# Altium schematic sheet CAN_Bus.SchDoc: Hrafn
size Tabloid; DrawnBy: Nicholas Belsten; Organization: MIT; Address1: Route 40; Address2: Westford MA 01886; Address3: USA; DocumentNumber: 8; SheetNumber: 10; SheetTotal: 10; DCN: Aika; ProgramName: AERO-VISTA; Section: CAN
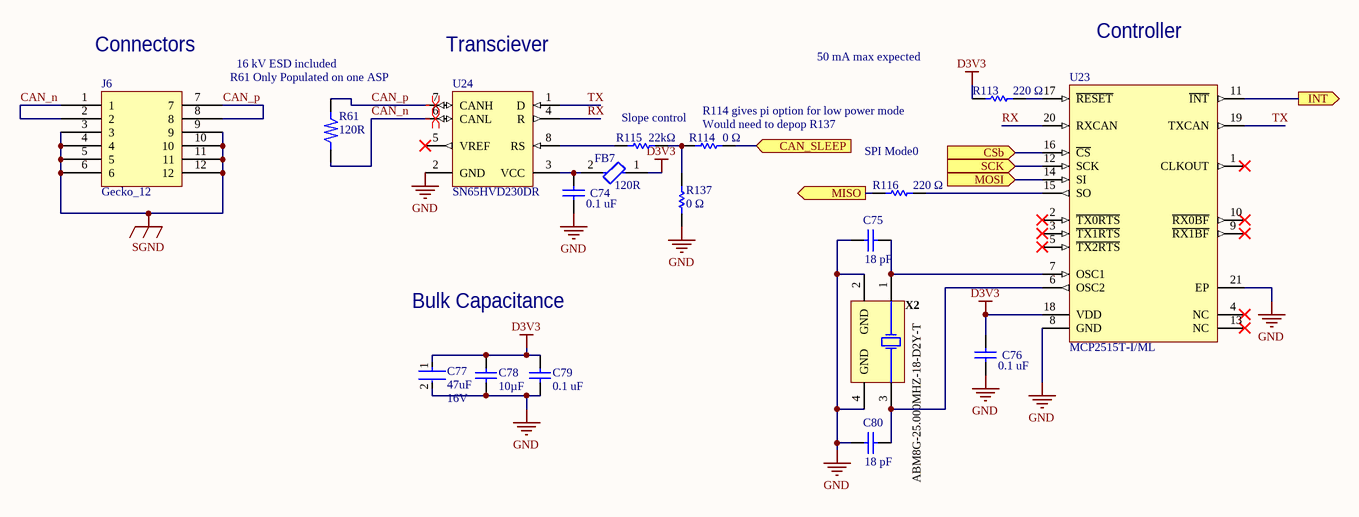
[diagram p0: CAN_Bus.SchDoc]

## Parts
C74  0.1 uF  [CAPC0402(1005)60_L]
C75  Capacitance: 18 pF  [CAPC1005X55X25LL05T10]  (hidden comment: GRM1555C1H180JA01D)
C76  0.1 uF  [CAPC0402(1005)60_L]
C77  Capacitance: 47uF  Voltage Rating: 16V  [FP-GRT32E-0_3-IPC_C]  (hidden comment: GRT32EC81C476ME13L)
C78  Capacitance: 10µF  [CAPC1608X100X35LL20T25]  (hidden comment: EMK107BBJ106MA-T)
C79  0.1 uF  [CAPC0402(1005)60_L]
C80  Capacitance: 18 pF  [CAPC1005X55X25LL05T10]  (hidden comment: GRM1555C1H180JA01D)
FB7  Impedance: 120R  [FP-BLM18-0_15-t0_8-IPC_C]  (hidden comment: BLM18PG121SH1D)
J6  Gecko_12  [GECK12]
R61  Resistance: 120R  [RESC1608X08L]  (hidden comment: R)
R113  220 Ω  [RESC1005X40X25LL05T05]
R114  Resistance: 0 Ω  [RESC1005X40X25LL05T05]  (hidden comment: ERJ2GE0R00X)
R115  22kΩ  [RESC1005X40X25LL05T05]
R116  220 Ω  [RESC1005X40X25LL05T05]
R137  Resistance: 0 Ω  [RESC1005X40X25LL05T05]  (hidden comment: ERJ2GE0R00X)
U23  MCP2515T-I/ML  [QFN-ML20_N]
U24  SN65HVD230DR  [D0008A_L]
X2  ABM8G-25.000MHZ-18-D2Y-T  [ABRA-ABM8G_V]

## Ports
CAN_SLEEP (in), CSb (in), INT (out), MISO (out), MOSI (in), SCK (in)

## Nets
D3V3: C76.2 C77.1 C78.2 C79.2 FB7.1 R113.1 U23.18(VDD)
GND: C74.1 C75.1 C76.1 C77.2 C78.1 C79.1 C80.1 R137.1 U23.8(GND) U23.21(EP) U24.2(GND) X2.2(GND) X2.4(GND)
SGND: J6.3 J6.4 J6.5 J6.6 J6.9 J6.10 J6.11 J6.12
CAN_n: J6.1 J6.2 R61.1 U24.6(CANL)
CAN_p: J6.7 J6.8 R61.0 U24.7(CANH)
CAN_SLEEP: R114.2 ; port CAN_SLEEP
CSb: U23.16(~{CS}) ; port CSb
INT: U23.11(~{INT}) ; port INT
MISO: R116.1 ; port MISO
MOSI: U23.14(SI) ; port MOSI
RX: U23.20(RXCAN) U24.4(R)
SCK: U23.12(SCK) ; port SCK
TX: U23.19(TXCAN) U24.1(D)
NetC74_2: C74.2 FB7.2 U24.3(VCC)
NetC75_2: C75.2 U23.7(OSC1) X2.1(X1)
NetC80_2: C80.2 U23.6(OSC2) X2.3(X2)
NetR113_2: R113.2 U23.17(~{RESET})
NetR114_1: R114.1 R115.2 R137.2
NetR115_1: R115.1 U24.8(RS)
NetR116_2: R116.2 U23.15(SO)

Not connected (* = marked no-connect by the designer): U23 1(CLKOUT)* 2(~{TX0RTS})* 3(~{TX1RTS})* 4(NC)* 5(~{TX2RTS})* 9(~{RX1BF})* 10(~{RX0BF})* 13(NC)*; U24 5(VREF)*

## Layout directives
differential pair: CAN_n, CAN_p

## Notes on the sheet
- Controller
- (near J6) Connectors
- (near R61) R61 Only Populated on one ASP
- 16 kV ESD included
- (near U24) Transciever
- Slope control
- (near R114) R114 gives pi option for low power mode
- 50 mA max expected
- (near R114) Would need to depop R137
- (near R116) SPI Mode0
- Bulk Capacitance
- Title
- Size
- Date
- Tabloid
- Section
- Time
- Sheet
- of
- Revision
- Drawn
- 33-207 / 77 Mass. Ave.
- Cambridge, MA 02139
- File

## Library data of the parts
C74 C76 C79 = CMP-1034-02068-1: CAP 100nF 16V ±5% 0402 (1005 Metric) Thickness 0.6mm SMD; Tolerance: Â±5%; Case-EIA: 0402; Case-Metric: 1005; Technology: SMT; Value: 100nF; Max Thickness: 0.6 mm; Rated Voltage: 16 V
C75 C80 = CMP-2008-03918-1: Manufacturer: Murata; Part Number: GRM1555C1H180JA01D
C77 = CMP-06035-034903-1: Multi-Layer Ceramic Capacitor 47uF 16V X6S ±20% 1210 Emboss T/R; Ratings: AEC-Q200; Thickness: 0.106inch; Max Operating Temperature: 105°C; Width: 0.098inch; Case/Package: 1210; Length: 0.126inch; Mount: Surface Mount; Min Operating Temperature: -55°C; Tolerance: 20%; Case Code (Imperial): 1210; Case Code (Metric): 3225; Packaging: Tape and Reel
C78 = CMP-2000-06226-1: Chip Capacitor, 10 uF, +/- 20%, 16 V, -55 to 85 degC, 0603 (1608 Metric), RoHS, Tape and Reel; Manufacturer: Taiyo Yuden; Voltage - Rated: 16V; Temperature Coefficient: X5R; Other Names: 587-3238-6; Online Catalog: MSeries; Features: -; Thickness (Max): 0.031"(0.80mm); Package / Case: 0603(1608Metric); Datasheet URL: http://www.yuden.co.jp/ut/product/category/capacitor/EMK107BBJ106MA-T.pdf; Category: Capacitors; Lead Style: -; Family: CeramicCapacitors; Package Description: 2-Pin Surface Mount Device, Body 1.70 x 0.90 mm; Tolerance: ±20%; Manufacturer URL: http://www.t-yuden.com/; Operating Temperature: -55°C~85°C; Lead Spacing: -; Height - Seated (Max): -; Series: M; Applications: GeneralPurpose; Size / Dimension: 0.063"Lx0.031"W(1.60mmx0.80mm); Standard Package: 1; Packaging: Digi-Reel®; Mounting Technology: SurfaceMount; Package Reference: 0603; Ratings: -; Datasheet Version: 10/2016; Mounting Type: SurfaceMount,MLCC
FB7 = CMP-06046-000335-1: Chip Ferrite Bead, 0603, 120Ω @ 100MHz, 0.05Ω, 25%, 2A; Shielding: Unshielded; Number of Lines: 1; DC Resistance (DCR): 50mR; Case/Package: 0603; Max Current Rating: 2A; Ratings: AEC-Q200; Case Code (Metric): 1608; Height: 0.8mm; Max DC Current: 2A; Contact Plating: Tin; Max Operating Temperature: 125°C; Width: 0.031inch; Number of Circuits: 1; Min Operating Temperature: -55°C; Mount: Surface Mount; Test Frequency: 100MHz; Tolerance: 25%; Packaging: Tape and Reel; Length: 1.6mm; Weight: 7.1E-05oz; Package Quantity: 4000; Case Code (Imperial): 0603; Termination: SMD/SMT; Material: Ferrite; Depth: 0.8mm; Lead Free: Lead Free; Current Rating: 2A
R61 = R: ROHM - ESR03EZPJ121 - RES, AEC-Q200, THICK FILM, 120R, 5%, 0603 ROHS COMPLIANT: YES; pin to pad: 0>2; Power Rating: 250mW; Temperature Coefficient: 200ppm/°C; Supplier 1: Digi-Key; Supplier Part Number 1: RHM120DCT-ND; Manufacturer 1: Rohm; Manufacturer Part Number 1: ESR03EZPJ121; RoHS: Yes; Category: Chip SMD Resistors; Stock 1: 21155; Pricing 1: 1=0.10000, 10=0.08200, 100=0.03160, 1000=0.01392, 2500=0.01202 (USD); Case/Package: 0603; Case Code (Metric): 1608; Case Code (Imperial): 0603; Size Code: 0603; Min Operating Temperature: -55°C; Max Operating Temperature: 155°C; Tolerance: 5%; Package Quantity: 1; Packaging: Tape and Reel; Resistor Type: Thick Film; Number of Terminations: 2; Max Power Dissipation: 250mW; Features: Automotive AEC-Q200; Series: ESR; Length: 0.063inch; Width: 0.031inch; Height: 0.022inch; Lead Free: Lead Free; RoHS Compliant: Yes; ComponentLink1URL: https://datasheet.ciiva.com/2495/esr-2495284.pdf?src-supplier=Digi-Key; ComponentLink1Description: https://datasheet.ciiva.com/2495/esr-2495284.pdf?src-supplier=Digi-Key; ComponentLink2URL: https://datasheet.ciiva.com/2495/esr-2495285.pdf?src-supplier=Digi-Key; ComponentLink2Description: https://datasheet.ciiva.com/2495/esr-2495285.pdf?src-supplier=Digi-Key; ComponentLink3URL: https://datasheet.ciiva.com/2495/esr-2495286.pdf?src-supplier=Digi-Key; ComponentLink3Description: https://datasheet.ciiva.com/2495/esr-2495286.pdf?src-supplier=Digi-Key
R113 R116 = CMP-2002-08356-1: Part Number: CRCW040220K0FKED; Manufacturer: Vishay Dale; Resistance: 220 Ω
R114 R137 = CMP-2000-07451-1: Chip Resistor, 0 Ohm, 0.1 W, -55 to 155 degC, 0402 (1005 Metric), RoHS, Tape and Reel; Manufacturer: Panasonic; Voltage Rating (DC): 50V; Temperature Coefficient: 600ppm/��C; Max Power Dissipation: 100mW; Tolerance: 5%; Number of Terminations: 2; Mount: SurfaceMount; Height: 0.35mm; Packaging: TapeandReel; Contact Plating: Tin; Manufacturer URL: http://www.panasonic.com/; Composition: ThickFilm; Max Operating Temperature: 155degC; REACH SVHC: NoSVHC; Case/Package: 0402; Package Reference: 402; Depth: 0.5mm; Package Description: 2-Pin Surface Mount Device, Body 1 x 0.5 mm; Datasheet URL: https://industrial.panasonic.com/cdbs/www-data/pdf/RDA0000/AOA0000C301.pdf; RoHSCompliant: True; Case Code (Imperial): 0402; Military Standard: Not; Min Operating Temperature: -55degC; Power Rating: 100mW; Datasheet Version: 03/2015; Length: 1mm; Case Code (Metric): 1005; Termination: SMD/SMT; Mounting Technology: SurfaceMount; Voltage Rating: 50V; Width: 0.02inch; Package Quantity: 1; Lead Free: LeadFree; Radiation Hardening: No
R115 = CMP-2002-00489-1: Manufacturer: Panasonic; Part Number: ERJ-2GEJ223X; Resistance: 22kΩ
U23 = CMP-0186-00186-1: Stand-Alone CAN Controller With SPI Interface, 20-Pin QFN, Industrial Temperature, Tape and Reel; ComponentLink3URL: http://www.microchip.com/stellent/groups/techpub_sg/documents/packagingspec/en012702.pdf; ComponentLink1Description: Manufacturer URL; ComponentLink3Description: Package Specification; ComponentLink2URL: http://ww1.microchip.com/downloads/en/DeviceDoc/21801F.pdf; DatasheetVersion: revF, Oct-2010; ComponentLink1URL: http://www.microchip.com/; PackageDescription: 20-Lead Plastic Quad Flat, No Lead Package (ML) - 4x4x0.9 mm Body [QFN]; ComponentLink2Description: Datasheet; PackageReference: QFN-ML20; PackageVersion: revBB, Aug-2009
U24 = CMP-0315-00015-2: 3.3V CAN Transceiver with Standby Mode, 17 mA, -40 to 85 degC, 8-pin SOIC (D), Green (RoHS & no Sb/Br); Manufacturer: Texas Instruments; Rating: Catalog; Transient Pulse Protection(V): -25 to 25; Receivers Per Package: 1; ICC(Max)(mA): 17; Supply Voltage(s)(V): 3.3; Low Power Mode: Standby; Mounting Technology: Surface Mount; PackageReference: D0008A; Footprint: PCA82C250; ComponentLink1URL: http://www.ti.com/general/docs/lit/getliterature.tsp?genericPartNumber=SN65HVD230&fileType=pdf; Code_JEDEC: MS-012AA; ComponentLink1Description: Datasheet; Eco-Plan: Green (RoHS & no Sb/Br); PartNumber: SN65HVD230DR; PackageDescription: 8-Pin Plastic Small Outline Integrated Circuit, 4.9 x 3.9 mm, Pitch 1.27 mm Pitch; Isolated: No; DatasheetVersion: SLOS346K; PackageVersion: revM, Jun-2011; SubFamily: CAN; Drivers Per Package: 1
X2 = CMP-2000-05733-1: Ultra Miniature Ceramic Glass Sealed SMD Crystal, 25 MHz, -40 to 85 degC, 4-Pin SMD, RoHS, Tape and Reel; Manufacturer: ABRACON; Frequency: 25MHz; Case Length: 3.2mm; Case Width: 2.5mm; ESR: 60Ohms; Frequency Stability: 30PPM; Tolerance: 20PPM; Case Height: 1mm; Load Capacitance: 18pF; Package Description: 4-Pin Surface Mount Device, Body 2.5 x 3.2 mm, Pitch 2.2 mm; Manufacturer URL: http://www.abracon.com/; Mounting Technology: SurfaceMount; Datasheet Version: 08/2015; Dimensions: 2.5mmWx3.2mmLx1mmH; Operating Temperature Range: -40Cto+85C; Packaging: Reel; RoHS: Details; Product Category: Crystals; Package Reference: ABM8G; Package / Case: 3.2mmx2.5mm; Brand: ABRACON; Datasheet URL: http://www.abracon.com/Resonators/ABM8G.pdf; Termination Style: SMD/SMT; Type: UltraMiniatureGlassSealedCrystal; Mounting Style: SMD/SMT; Series: ABM8G; Factory Pack Quantity: 1000